# Altium project Femto_tester_v1.PrjPcb
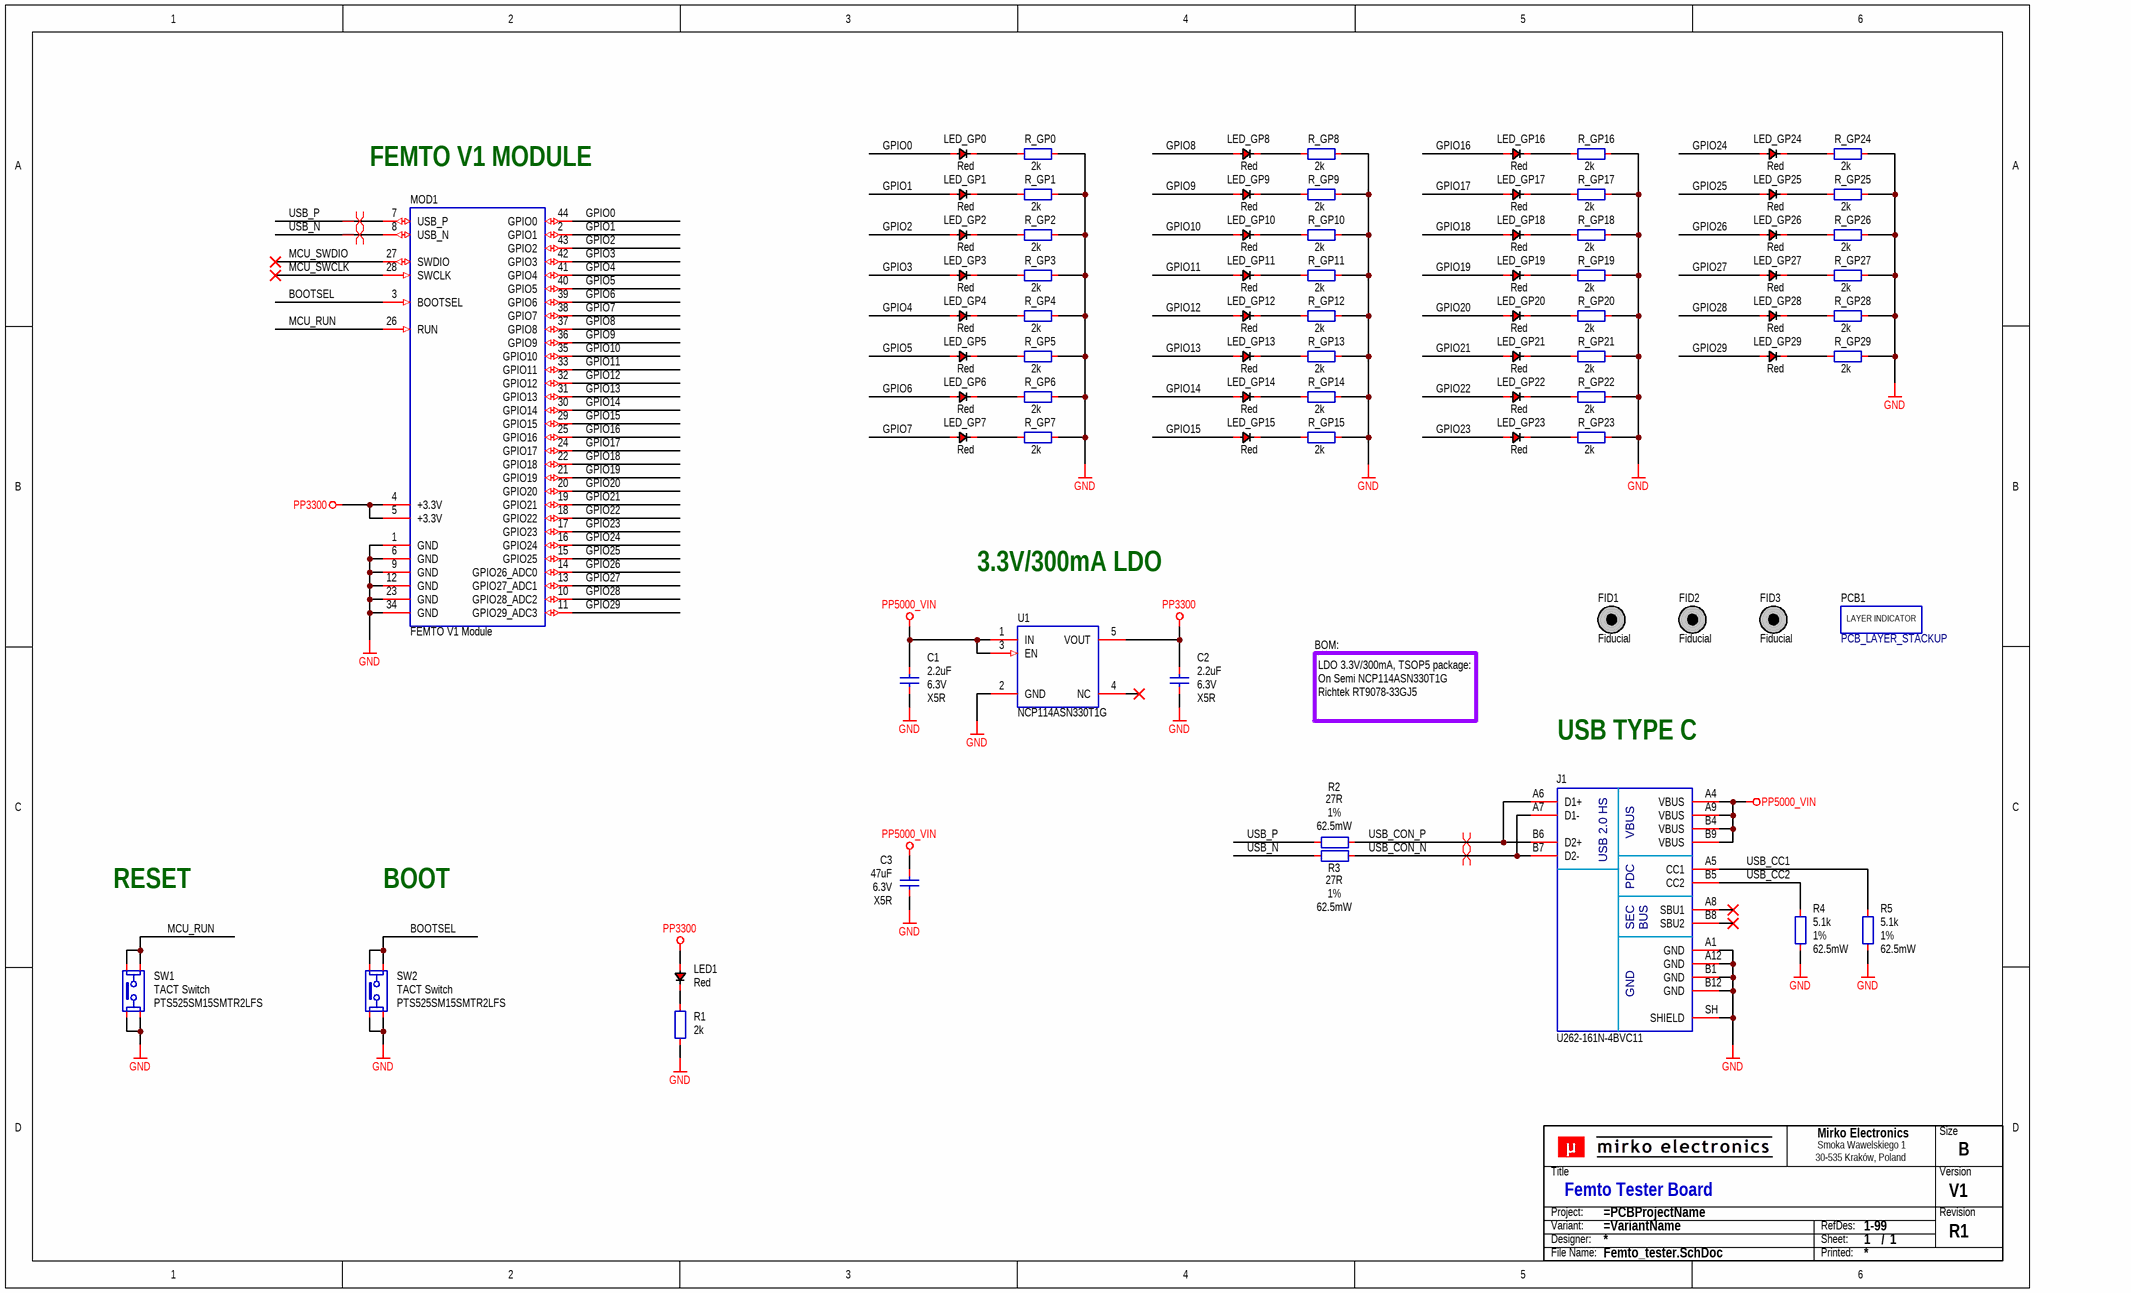
[diagram p0: Femto_tester.SchDoc]
SchPcbRevision: R1; SchPcbVersion: V1
1 sheet, 79 parts. Net scope: global (net labels, ports and power ports of the same name join across sheets).
Board file: Femto_tester_v1.PcbDoc

## Sheet Femto_tester.SchDoc: Femto Tester Board
size B; DocumentNumber: 1; SheetNumber: 1; SheetTotal: 1; PageSize: B; Designators: 1-99

### Parts
C1  2.2uF  Voltage Rating: 6.3V  Dielectric: X5R  [CAP_0402_R]
C2  2.2uF  Voltage Rating: 6.3V  Dielectric: X5R  [CAP_0402_R]
C3  47uF  Voltage Rating: 6.3V  Dielectric: X5R  [CAP_0603_R]
FID1  Fiducial  [PCB_FID_RND_100x300]  (no BOM)
FID2  Fiducial  [PCB_FID_RND_100x300]  (no BOM)
FID3  Fiducial  [PCB_FID_RND_100x300]  (no BOM)
J1  U262-161N-4BVC11  [CON_XKB_U262-161N-4BVC11]
LED1  Red  [LED_0402_R]
LED_GP0  Red  [LED_0402_R]
LED_GP1  Red  [LED_0402_R]
LED_GP2  Red  [LED_0402_R]
LED_GP3  Red  [LED_0402_R]
LED_GP4  Red  [LED_0402_R]
LED_GP5  Red  [LED_0402_R]
LED_GP6  Red  [LED_0402_R]
LED_GP7  Red  [LED_0402_R]
LED_GP8  Red  [LED_0402_R]
LED_GP9  Red  [LED_0402_R]
LED_GP10  Red  [LED_0402_R]
LED_GP11  Red  [LED_0402_R]
LED_GP12  Red  [LED_0402_R]
LED_GP13  Red  [LED_0402_R]
LED_GP14  Red  [LED_0402_R]
LED_GP15  Red  [LED_0402_R]
LED_GP16  Red  [LED_0402_R]
LED_GP17  Red  [LED_0402_R]
LED_GP18  Red  [LED_0402_R]
LED_GP19  Red  [LED_0402_R]
LED_GP20  Red  [LED_0402_R]
LED_GP21  Red  [LED_0402_R]
LED_GP22  Red  [LED_0402_R]
LED_GP23  Red  [LED_0402_R]
LED_GP24  Red  [LED_0402_R]
LED_GP25  Red  [LED_0402_R]
LED_GP26  Red  [LED_0402_R]
LED_GP27  Red  [LED_0402_R]
LED_GP28  Red  [LED_0402_R]
LED_GP29  Red  [LED_0402_R]
MOD1  FEMTO V1 Module  [MOD_FEMTO_V1_120X120_P100]
PCB1  PCB_LAYER_STACKUP  [PCB_STACKUP-2L_A1]  (no BOM)
R1  2k  [RES_0402_R]
R2  27R  Tolerance: 1%  Power Rating: 62.5mW  [RES_0402_R]
R3  27R  Tolerance: 1%  Power Rating: 62.5mW  [RES_0402_R]
R4  5.1k  Tolerance: 1%  Power Rating: 62.5mW  [RES_0402_R]
R5  5.1k  Tolerance: 1%  Power Rating: 62.5mW  [RES_0402_R]
R_GP0  2k  [RES_0402_R]
R_GP1  2k  [RES_0402_R]
R_GP2  2k  [RES_0402_R]
R_GP3  2k  [RES_0402_R]
R_GP4  2k  [RES_0402_R]
R_GP5  2k  [RES_0402_R]
R_GP6  2k  [RES_0402_R]
R_GP7  2k  [RES_0402_R]
R_GP8  2k  [RES_0402_R]
R_GP9  2k  [RES_0402_R]
R_GP10  2k  [RES_0402_R]
R_GP11  2k  [RES_0402_R]
R_GP12  2k  [RES_0402_R]
R_GP13  2k  [RES_0402_R]
R_GP14  2k  [RES_0402_R]
R_GP15  2k  [RES_0402_R]
R_GP16  2k  [RES_0402_R]
R_GP17  2k  [RES_0402_R]
R_GP18  2k  [RES_0402_R]
R_GP19  2k  [RES_0402_R]
R_GP20  2k  [RES_0402_R]
R_GP21  2k  [RES_0402_R]
R_GP22  2k  [RES_0402_R]
R_GP23  2k  [RES_0402_R]
R_GP24  2k  [RES_0402_R]
R_GP25  2k  [RES_0402_R]
R_GP26  2k  [RES_0402_R]
R_GP27  2k  [RES_0402_R]
R_GP28  2k  [RES_0402_R]
R_GP29  2k  [RES_0402_R]
SW1  TACT Switch  MPN: PTS525SM15SMTR2LFS  [SWI_CKS_PTS525]
SW2  TACT Switch  MPN: PTS525SM15SMTR2LFS  [SWI_CKS_PTS525]
TB?  Title block  (value not drawn)  (graphical)
U1  NCP114ASN330T1G  [ICC_TSOT-5_290X160H110_P95]

### Nets
GND: C1.1 C2.1 C3.1 J1.A1(GND) J1.A12(GND) J1.B1(GND) J1.B12(GND) J1.SH(SHIELD) MOD1.1(GND) MOD1.6(GND) MOD1.9(GND) MOD1.12(GND) MOD1.23(GND) MOD1.34(GND) R1.1 R4.1 R5.1 R_GP0.1 R_GP1.1 R_GP2.1 R_GP3.1 R_GP4.1 R_GP5.1 R_GP6.1 R_GP7.1 R_GP8.1 R_GP9.1 R_GP10.1 R_GP11.1 R_GP12.1 R_GP13.1 R_GP14.1 R_GP15.1 R_GP16.1 R_GP17.1 R_GP18.1 R_GP19.1 R_GP20.1 R_GP21.1 R_GP22.1 R_GP23.1 R_GP24.1 R_GP25.1 R_GP26.1 R_GP27.1 R_GP28.1 R_GP29.1 SW1.3 SW1.4 SW2.3 SW2.4 U1.2(GND)
PP3300: C2.2 LED1.2 MOD1.4(+3.3V) MOD1.5(+3.3V) U1.5(VOUT)
PP5000_VIN: C1.2 C3.2 J1.A4(VBUS) J1.A9(VBUS) J1.B4(VBUS) J1.B9(VBUS) U1.1(IN) U1.3(EN)
BOOTSEL: MOD1.3(BOOTSEL) SW2.1 SW2.2
GPIO0: LED_GP0.2 MOD1.44(GPIO0)
GPIO1: LED_GP1.2 MOD1.2(GPIO1)
GPIO2: LED_GP2.2 MOD1.43(GPIO2)
GPIO3: LED_GP3.2 MOD1.42(GPIO3)
GPIO4: LED_GP4.2 MOD1.41(GPIO4)
GPIO5: LED_GP5.2 MOD1.40(GPIO5)
GPIO6: LED_GP6.2 MOD1.39(GPIO6)
GPIO7: LED_GP7.2 MOD1.38(GPIO7)
GPIO8: LED_GP8.2 MOD1.37(GPIO8)
GPIO9: LED_GP9.2 MOD1.36(GPIO9)
GPIO10: LED_GP10.2 MOD1.35(GPIO10)
GPIO11: LED_GP11.2 MOD1.33(GPIO11)
GPIO12: LED_GP12.2 MOD1.32(GPIO12)
GPIO13: LED_GP13.2 MOD1.31(GPIO13)
GPIO14: LED_GP14.2 MOD1.30(GPIO14)
GPIO15: LED_GP15.2 MOD1.29(GPIO15)
GPIO16: LED_GP16.2 MOD1.25(GPIO16)
GPIO17: LED_GP17.2 MOD1.24(GPIO17)
GPIO18: LED_GP18.2 MOD1.22(GPIO18)
GPIO19: LED_GP19.2 MOD1.21(GPIO19)
GPIO20: LED_GP20.2 MOD1.20(GPIO20)
GPIO21: LED_GP21.2 MOD1.19(GPIO21)
GPIO22: LED_GP22.2 MOD1.18(GPIO22)
GPIO23: LED_GP23.2 MOD1.17(GPIO23)
GPIO24: LED_GP24.2 MOD1.16(GPIO24)
GPIO25: LED_GP25.2 MOD1.15(GPIO25)
GPIO26: LED_GP26.2 MOD1.14(GPIO26_ADC0)
GPIO27: LED_GP27.2 MOD1.13(GPIO27_ADC1)
GPIO28: LED_GP28.2 MOD1.10(GPIO28_ADC2)
GPIO29: LED_GP29.2 MOD1.11(GPIO29_ADC3)
MCU_RUN: MOD1.26(RUN) SW1.1 SW1.2
MCU_SWCLK: MOD1.28(SWCLK)
MCU_SWDIO: MOD1.27(SWDIO)
USB_CC1: J1.A5(CC1) R5.2
USB_CC2: J1.B5(CC2) R4.2
USB_CON_N: J1.A7(D1-) J1.B7(D2-) R3.2
USB_CON_P: J1.A6(D1+) J1.B6(D2+) R2.2
USB_N: MOD1.8(USB_N) R3.1
USB_P: MOD1.7(USB_P) R2.1
NetLED1_1: LED1.1 R1.2
NetLED_GP0_1: LED_GP0.1 R_GP0.2
NetLED_GP1_1: LED_GP1.1 R_GP1.2
NetLED_GP2_1: LED_GP2.1 R_GP2.2
NetLED_GP3_1: LED_GP3.1 R_GP3.2
NetLED_GP4_1: LED_GP4.1 R_GP4.2
NetLED_GP5_1: LED_GP5.1 R_GP5.2
NetLED_GP6_1: LED_GP6.1 R_GP6.2
NetLED_GP7_1: LED_GP7.1 R_GP7.2
NetLED_GP8_1: LED_GP8.1 R_GP8.2
NetLED_GP9_1: LED_GP9.1 R_GP9.2
NetLED_GP10_1: LED_GP10.1 R_GP10.2
NetLED_GP11_1: LED_GP11.1 R_GP11.2
NetLED_GP12_1: LED_GP12.1 R_GP12.2
NetLED_GP13_1: LED_GP13.1 R_GP13.2
NetLED_GP14_1: LED_GP14.1 R_GP14.2
NetLED_GP15_1: LED_GP15.1 R_GP15.2
NetLED_GP16_1: LED_GP16.1 R_GP16.2
NetLED_GP17_1: LED_GP17.1 R_GP17.2
NetLED_GP18_1: LED_GP18.1 R_GP18.2
NetLED_GP19_1: LED_GP19.1 R_GP19.2
NetLED_GP20_1: LED_GP20.1 R_GP20.2
NetLED_GP21_1: LED_GP21.1 R_GP21.2
NetLED_GP22_1: LED_GP22.1 R_GP22.2
NetLED_GP23_1: LED_GP23.1 R_GP23.2
NetLED_GP24_1: LED_GP24.1 R_GP24.2
NetLED_GP25_1: LED_GP25.1 R_GP25.2
NetLED_GP26_1: LED_GP26.1 R_GP26.2
NetLED_GP27_1: LED_GP27.1 R_GP27.2
NetLED_GP28_1: LED_GP28.1 R_GP28.2
NetLED_GP29_1: LED_GP29.1 R_GP29.2

Not connected (* = marked no-connect by the designer): J1 A8(SBU1)* B8(SBU2)*; U1 4(NC)*

### Layout directives
differential pair: USB_CON_N, USB_CON_P, USB_N, USB_P

### Notes on the sheet
- (near MOD1) FEMTO V1 MODULE
- 3.3V/300mA LDO
- BOM:
- LDO 3.3V/300mA, TSOP5 package:
  On Semi NCP114ASN330T1G
  Richtek RT9078-33GJ5
- USB TYPE C
- RESET
- BOOT
- (in symbol CON_USB_TYPE_C_16P) USB 2.0 HS; PDC; SEC; BUS
- (in symbol PCB_LAYER_STACKUP) LAYER INDICATOR
- (in symbol SCH_TITLE_BLOCK_V1) Mirko Electronics; Size; Smoka Wawelskiego 1; 30-535 Kraków, Poland; Title; Version; Project:; Revision; Variant:; RefDes:; Designer:; Sheet:; /; File Name:; Printed:

### Library data of the parts
C1 C2 = CAP-0026: Capacitor; MLCC; GENERIC; TBD; TBD; TBD; TBD; SMD; 0402 (1005);; Manufacturer: Samsung Electro-Mechanics; MPN: CL05A225MQ5NNNC; Component Body: 1.00 x 0.50mm; ID: CAP-0026; Component Type: Capacitor; Component Subtype: MLCC; Value: 2.2uF; Mounting Type: SMD; Package (Case): 0402 (1005); Component Height: TBD; Packaging Type: TBD; ROHS Status: TBD; Operating Temperature: TBD; Capacitance: 2.2uF; Tolerance: TBD; Features: TBD; Supplier 1: LCSC; Supplier 2: Farnell; Supplier Part Number 1: C107371; Supplier Part Number 2: 3013335; Supplier 3: Mouser; Supplier Part Number 3: 187-CL05A225MQ5NNNC
C3 = CAP-0023: Capacitor; MLCC; GENERIC; TBD; TBD; TBD; TBD; SMD; 0603 (1608);; Manufacturer: Murata Electronics; ID: CAP-0023; Component Type: Capacitor; Component Subtype: MLCC; Value: 47uF; MPN: GENERIC; Mounting Type: SMD; Package (Case): 0603 (1608); Component Body: TBD; Component Height: TBD; Packaging Type: TBD; ROHS Status: TBD; Operating Temperature: TBD; Capacitance: 47uF; Tolerance: TBD; Features: TBD; Supplier 1: LCSC; Supplier 2: Farnell; Supplier 3: Mouser; Supplier Part Number 1: C140782; Supplier Part Number 2: 3582851; Supplier Part Number 3: 81-GRM188R60J476ME5J
FID1-FID3 = PCB_FID_RND: PCB Marking; Fiducial; Round;; Value: Fiducial; Component Subtype: -; Component Type: Fiducial; Mounting Type: -; Supplier 1: LCSC; Supplier 2: Farnell; Supplier 3: Mouser
J1 = CON_USB_TYPE_C_16P: Connector; USB 3.1 Type C; Receptacle; 24-pin; USB 2.0 Only;; Manufacturer: XKB Connectivity; Component Subtype: USB-C; Package (Case): SMD; Value: U262-161N-4BVC11; MPN: U262-161N-4BVC11; Component Type: Connector; Mounting Type: SMD; Supplier: ?
LED1 LED_GP0-LED_GP29 = DIO_LED_RED: Diode; LED; Red;; Component Subtype: LED Diode; Package (Case): 0402 (1005); Value: Red; Component Type: LED; Mounting Type: SMD; Supplier 1: LCSC; Supplier 2: Farnell; Supplier Part Number 1: C965790; Supplier Part Number 2: 2900754; Supplier 3: Mouser; Supplier Part Number 3: 710-150040RS73240
MOD1 = MOD_FEMTO_V1_LGA40: PCB Module; FEMTO V1; LGA40; Pitch 1mm;; Value: FEMTO V1 Module
R1 R_GP0-R_GP29 = RES-0058: Resistor; Thick Film; GENERIC; TBD; TBD; TBD; TBD; TBD; SMD; 0402 (1005);; Manufacturer: Yageo Corporation; MPN: RC0402FR-072KP; Component Body: 1.00 x 0.50mm; Tolerance: 1%; Power Rating: 62.5mW; Voltage Rating: 50V; ID: RES-0058; Component Type: Resistor; Component Subtype: Thick Film; Value: 2k; Mounting Type: SMD; Package (Case): 0402 (1005); Component Height: TBD; Packaging Type: TBD; ROHS Status: TBD; Operating Temperature: TBD; Resistance: 2k; TCR: TBD; Features: TBD; Supplier 1: LCSC; Supplier 2: Farnell; Supplier Part Number 1: C60488; Supplier Part Number 2: 1458757; Supplier 3: Mouser; Supplier Part Number 3: 603-RC0402FR-072KL
R2 R3 = RES-0058: Resistor; Thick Film; GENERIC; TBD; TBD; TBD; TBD; TBD; SMD; 0402 (1005);; Manufacturer: Yageo Corporation; MPN: RC0402FR-0727RL; Component Body: 1.00 x 0.50mm; Voltage Rating: 50V; ID: RES-0058; Component Type: Resistor; Component Subtype: Thick Film; Value: 27R; Mounting Type: SMD; Package (Case): 0402 (1005); Component Height: TBD; Packaging Type: TBD; ROHS Status: TBD; Operating Temperature: TBD; Resistance: 27R; TCR: TBD; Features: TBD; Supplier 1: LCSC; Supplier 2: Farnell; Supplier Part Number 1: C138021; Supplier Part Number 2: 9239049; Supplier 3: Mouser; Supplier Part Number 3: 603-RC0402FR-0727RL
R4 R5 = RES-0058: Resistor; Thick Film; GENERIC; TBD; TBD; TBD; TBD; TBD; SMD; 0402 (1005);; Manufacturer: Yageo Corporation; MPN: RC0402FR-075K1L; Component Body: 1.00 x 0.50mm; ID: RES-0058; Component Type: Resistor; Component Subtype: Thick Film; Value: 5.1k; Mounting Type: SMD; Package (Case): 0402 (1005); Component Height: TBD; Packaging Type: TBD; ROHS Status: TBD; Operating Temperature: TBD; Resistance: 5.1k; TCR: TBD; Voltage Rating: TBD; Features: TBD; Supplier 1: LCSC; Supplier 2: Farnell; Supplier 3: Mouser; Supplier Part Number 1: C105872; Supplier Part Number 2: 1458805; Supplier Part Number 3: 603-RC0402FR-075K1L
SW1 SW2 = SWI_TACT_4P_AABB: Switch; Tactile; Monostable;; Manufacturer: C&K Switches; Package (Case): 3780595; Value: TACT Switch; Component Subtype: TACT Switch; Component Type: Switch; Mounting Type: SMD; Supplier 1: LCSC; Supplier 2: Farnell; Supplier Part Number 1: C221856; Supplier Part Number 2: 3023207; Supplier 3: Mouser; Supplier Part Number 3: 611-PTS525SM15SMTR2
TB? = SCH_TITLE_BLOCK_V1: Component Type: Title block; Manufacturer: -; Mounting Type: Non component; MPN: -; Operating Temperature: -; Package: -; Specification: Title block; Value: Title block; Replacement: -; System: ?
U1 = ICC_ONS_NCP114_TSOP5: ICC; LDO;; MPN: NCP114ASN330T1G; Supplier 1: LCSC; Supplier 2: Farnell; Supplier 3: Mouser; Supplier Part Number 1: C457666; Supplier Part Number 2: 2677151; Supplier Part Number 3: 863-NCP114ASN330T1G; Value: NCP114ASN330T1G
PCB1 = PCB_LAYER_STACKUP: Component Subtype: -; Component Type: PCB Marking; Mounting Type: -; Supplier 1: LCSC; Supplier 2: Farnell; Supplier 3: Mouser